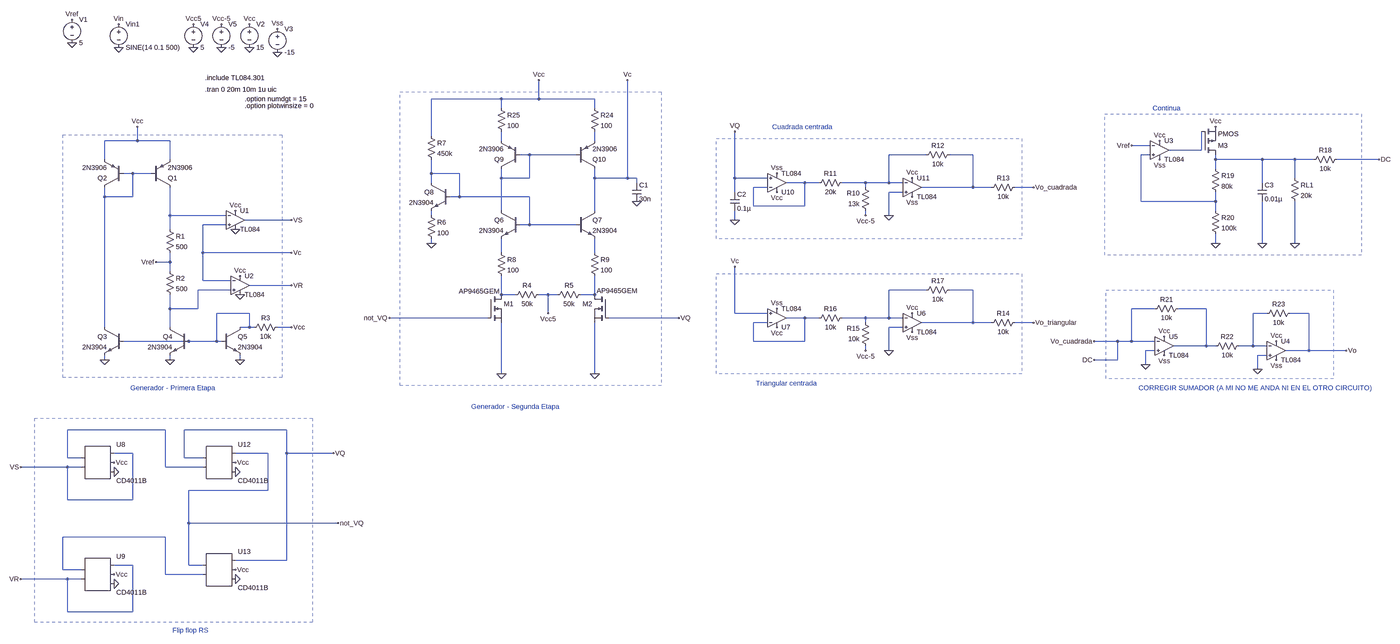
[diagram p0: schematic CIRCUITO_FINAL_PROLIJO3.asc, whole sheet]
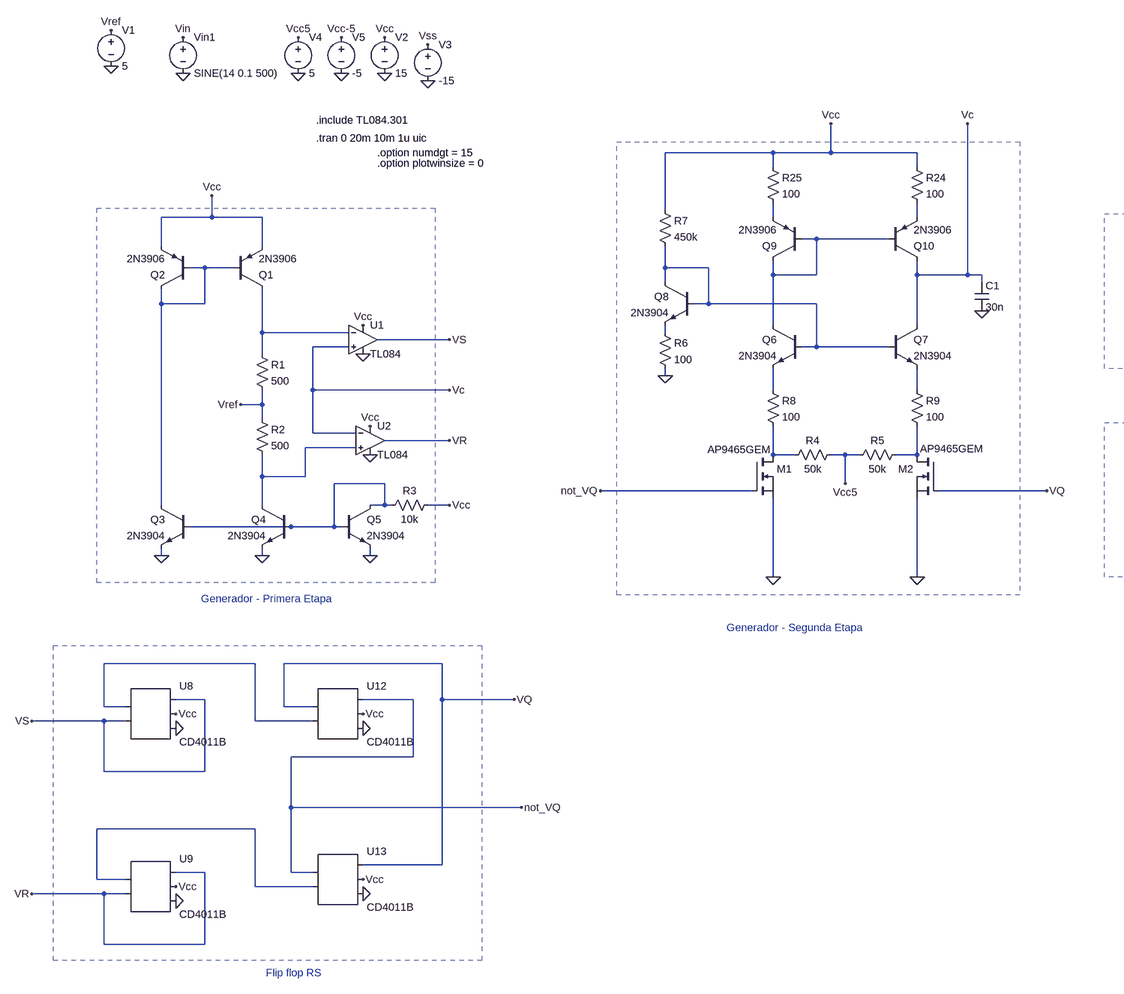
[diagram p1: schematic CIRCUITO_FINAL_PROLIJO3.asc, part, row 1 of 1, column 1 of 2]
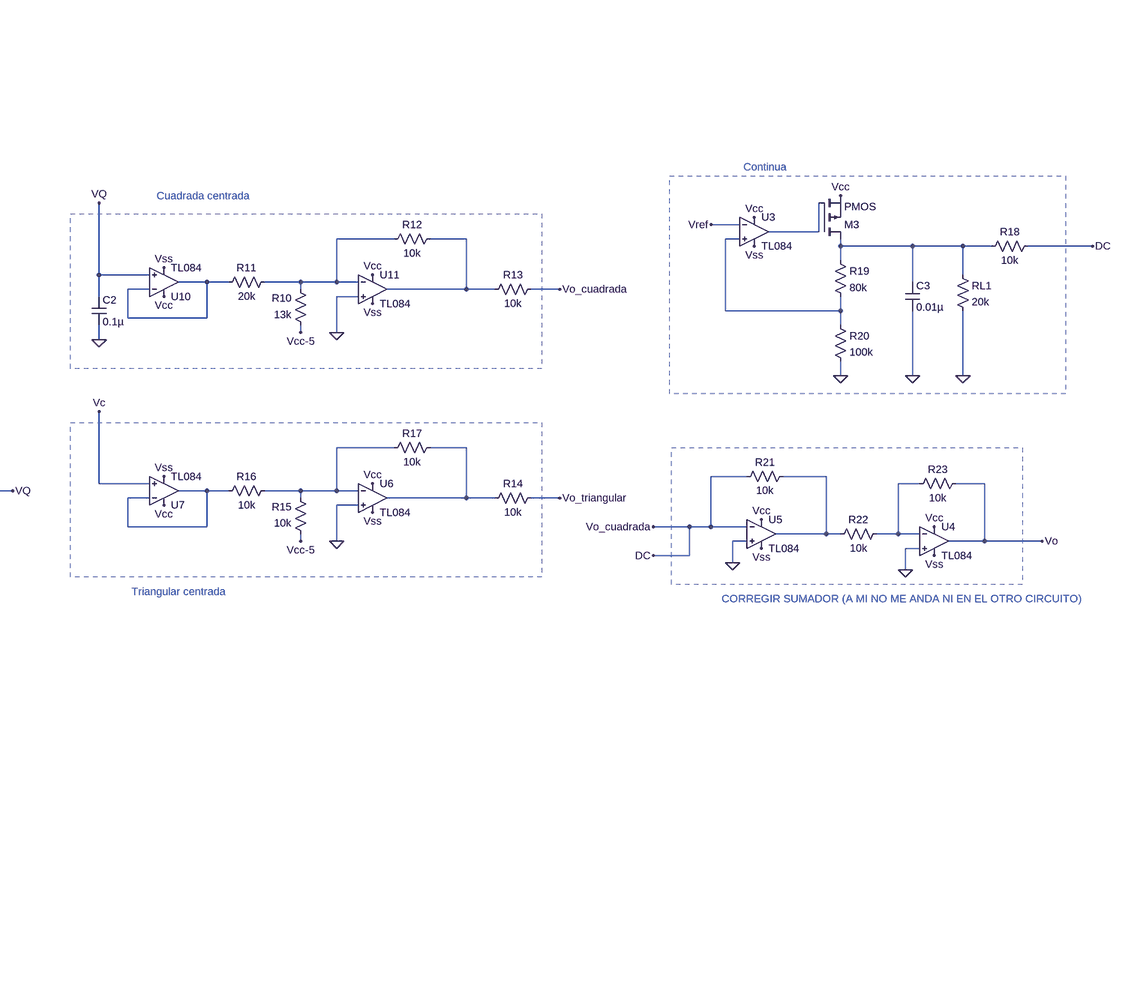
[diagram p2: schematic CIRCUITO_FINAL_PROLIJO3.asc, part, row 1 of 1, column 2 of 2]
CIRCUITO_FINAL_PROLIJO3.asc, the LTspice schematic file:
Version 4
SHEET 1 4360 1968
WIRE 848 -176 608 -176
WIRE 976 -176 976 -240
WIRE 976 -176 848 -176
WIRE 1168 -176 976 -176
WIRE 848 -144 848 -176
WIRE 1168 -144 1168 -176
WIRE 608 -48 608 -176
WIRE -400 -32 -400 -80
WIRE -400 -32 -512 -32
WIRE -288 -32 -400 -32
WIRE 848 -32 848 -64
WIRE 1168 -32 1168 -64
WIRE 3072 -16 3008 -16
WIRE 3248 0 3248 -64
WIRE 3248 0 3136 0
WIRE 944 16 912 16
WIRE 1104 16 944 16
WIRE 2304 16 2176 16
WIRE 2464 16 2384 16
WIRE 3072 16 3040 16
WIRE -512 32 -512 -32
WIRE -288 32 -288 -32
WIRE 3296 32 3296 16
WIRE 3456 32 3296 32
WIRE 3568 32 3456 32
WIRE 3632 32 3568 32
WIRE 3856 32 3712 32
WIRE 3296 64 3296 32
WIRE -416 80 -448 80
WIRE -352 80 -416 80
WIRE 608 80 608 32
WIRE 704 80 608 80
WIRE 848 96 848 64
WIRE 944 96 944 16
WIRE 944 96 848 96
WIRE 1168 96 1168 64
WIRE 1280 96 1280 -240
WIRE 1280 96 1168 96
WIRE 1312 96 1280 96
WIRE 1648 96 1648 -64
WIRE 1760 96 1648 96
WIRE 3568 96 3568 32
WIRE 608 112 608 80
WIRE 1312 112 1312 96
WIRE 1888 112 1824 112
WIRE 1936 112 1888 112
WIRE 2096 112 2016 112
WIRE 2176 112 2176 16
WIRE 2176 112 2096 112
WIRE 2224 112 2176 112
WIRE 3456 112 3456 32
WIRE 1760 128 1712 128
WIRE 2096 128 2096 112
WIRE 2464 128 2464 16
WIRE 2464 128 2288 128
WIRE 2528 128 2464 128
WIRE 2672 128 2608 128
WIRE 1648 144 1648 96
WIRE 2224 144 2176 144
WIRE -512 160 -512 128
WIRE -416 160 -416 80
WIRE -416 160 -512 160
WIRE 704 160 704 80
WIRE 704 160 672 160
WIRE 944 160 704 160
WIRE 3040 176 3040 16
WIRE 3296 176 3296 144
WIRE 3296 176 3040 176
WIRE 1712 192 1712 128
WIRE 1888 192 1888 112
WIRE 1888 192 1712 192
WIRE 848 208 848 96
WIRE 1168 208 1168 96
WIRE 3296 208 3296 176
WIRE -288 224 -288 128
WIRE -96 224 -288 224
WIRE 608 224 608 208
WIRE 2096 224 2096 208
WIRE 2176 224 2176 144
WIRE 128 240 -32 240
WIRE 1648 240 1648 208
WIRE -96 256 -176 256
WIRE 944 256 944 160
WIRE 944 256 912 256
WIRE 1104 256 944 256
WIRE -288 272 -288 224
WIRE 608 320 608 304
WIRE 3296 320 3296 288
WIRE 3456 320 3456 176
WIRE 3568 320 3568 176
WIRE -176 352 -176 256
WIRE 128 352 -176 352
WIRE 848 352 848 304
WIRE 1168 352 1168 304
WIRE -288 384 -288 352
WIRE -288 384 -336 384
WIRE -288 416 -288 384
WIRE -176 448 -176 352
WIRE -80 448 -176 448
WIRE 128 464 -16 464
WIRE -80 480 -192 480
WIRE 2304 480 2176 480
WIRE 2464 480 2384 480
WIRE 848 496 848 432
WIRE 896 496 848 496
WIRE 1008 496 976 496
WIRE 1040 496 1008 496
WIRE 1168 496 1168 432
WIRE 1168 496 1120 496
WIRE -288 544 -288 496
WIRE -192 544 -192 480
WIRE -192 544 -288 544
WIRE 3088 544 3008 544
WIRE 3264 544 3168 544
WIRE -16 560 -128 560
WIRE 1008 560 1008 496
WIRE 1648 560 1648 400
WIRE 1760 560 1648 560
WIRE 3472 560 3424 560
WIRE 3616 560 3552 560
WIRE 800 576 464 576
WIRE 1456 576 1216 576
WIRE 1888 576 1824 576
WIRE 1936 576 1888 576
WIRE 2096 576 2016 576
WIRE 2176 576 2176 480
WIRE 2176 576 2096 576
WIRE 2224 576 2176 576
WIRE 1760 592 1712 592
WIRE 2096 592 2096 576
WIRE 2464 592 2464 480
WIRE 2464 592 2288 592
WIRE 2528 592 2464 592
WIRE 2672 592 2608 592
WIRE -512 608 -512 160
WIRE -288 608 -288 544
WIRE -16 608 -16 560
WIRE -16 608 -48 608
WIRE 0 608 -16 608
WIRE 128 608 80 608
WIRE 2224 608 2176 608
WIRE -224 656 -448 656
WIRE -128 656 -128 560
WIRE -128 656 -224 656
WIRE -112 656 -128 656
WIRE 1712 656 1712 592
WIRE 1888 656 1888 576
WIRE 1888 656 1712 656
WIRE 2960 656 2880 656
WIRE 3008 656 3008 544
WIRE 3008 656 2960 656
WIRE 3088 656 3008 656
WIRE 3264 672 3264 544
WIRE 3264 672 3152 672
WIRE 3296 672 3264 672
WIRE 3424 672 3424 560
WIRE 3424 672 3376 672
WIRE 3472 672 3424 672
WIRE 2096 688 2096 672
WIRE 2176 688 2176 608
WIRE 3088 688 3056 688
WIRE 3616 688 3616 560
WIRE 3616 688 3536 688
WIRE 3744 688 3616 688
WIRE 3472 704 3440 704
WIRE -512 720 -512 704
WIRE -288 720 -288 704
WIRE -48 720 -48 704
WIRE 2960 720 2960 656
WIRE 2960 720 2880 720
WIRE 3056 736 3056 688
WIRE 3440 752 3440 704
WIRE 848 768 848 592
WIRE 1168 768 1168 592
WIRE -304 960 -640 960
WIRE 112 960 -240 960
WIRE -416 1040 -480 1040
WIRE 48 1040 -64 1040
WIRE 112 1040 112 960
WIRE 272 1040 112 1040
WIRE -640 1056 -640 960
WIRE -592 1056 -640 1056
WIRE -240 1056 -240 960
WIRE -176 1056 -240 1056
WIRE -640 1088 -800 1088
WIRE -592 1088 -640 1088
WIRE -304 1088 -304 960
WIRE -176 1088 -304 1088
WIRE 48 1168 48 1040
WIRE 48 1168 -224 1168
WIRE -640 1200 -640 1088
WIRE -416 1200 -416 1040
WIRE -416 1200 -640 1200
WIRE -224 1280 -224 1168
WIRE 288 1280 -224 1280
WIRE -304 1328 -656 1328
WIRE 112 1408 112 1040
WIRE 112 1408 -64 1408
WIRE -416 1424 -480 1424
WIRE -224 1424 -224 1280
WIRE -176 1424 -224 1424
WIRE -656 1440 -656 1328
WIRE -592 1440 -656 1440
WIRE -304 1456 -304 1328
WIRE -176 1456 -304 1456
WIRE -640 1472 -800 1472
WIRE -592 1472 -640 1472
WIRE -640 1584 -640 1472
WIRE -416 1584 -416 1424
WIRE -416 1584 -640 1584
FLAG -48 720 0
FLAG -288 720 0
FLAG -512 720 0
FLAG 608 320 0
FLAG 1312 176 0
FLAG 976 -240 Vcc
FLAG 1008 560 Vcc5
FLAG 1168 768 0
FLAG 848 768 0
FLAG -400 -80 Vcc
FLAG 128 608 Vcc
FLAG 128 240 VS
FLAG 128 464 VR
FLAG -336 384 Vref
FLAG 128 352 Vc
FLAG 1456 576 VQ
FLAG 464 576 not_VQ
FLAG 1280 -240 Vc
FLAG -624 -368 0
FLAG -16 -432 Vcc
FLAG 80 -416 Vss
FLAG 80 -336 0
FLAG -16 -352 0
FLAG -208 -432 Vcc5
FLAG -208 -352 0
FLAG -112 -352 0
FLAG -112 -432 Vcc-5
FLAG -464 -432 Vin
FLAG -464 -352 0
FLAG -624 -448 Vref
FLAG 1792 144 Vcc
FLAG 1792 80 Vss
FLAG 1648 240 0
FLAG 2096 224 Vcc-5
FLAG 2176 224 0
FLAG 1648 -64 VQ
FLAG 2672 128 Vo_cuadrada
FLAG 3296 320 0
FLAG 3568 320 0
FLAG 3456 320 0
FLAG 3856 32 DC
FLAG 3744 688 Vo
FLAG 3056 736 0
FLAG 3440 752 0
FLAG 2256 96 Vcc
FLAG 2256 160 Vss
FLAG 1792 608 Vcc
FLAG 1792 544 Vss
FLAG 2096 688 Vcc-5
FLAG 2176 688 0
FLAG 1648 400 Vc
FLAG 2672 592 Vo_triangular
FLAG 2256 560 Vcc
FLAG 2256 624 Vss
FLAG 3104 -32 Vcc
FLAG 3104 32 Vss
FLAG 3504 656 Vcc
FLAG 3504 720 Vss
FLAG 3120 640 Vcc
FLAG 3120 704 Vss
FLAG -64 208 Vcc
FLAG -64 272 0
FLAG -48 432 Vcc
FLAG -48 496 0
FLAG -800 1088 VS
FLAG -800 1472 VR
FLAG -480 1488 0
FLAG -480 1104 0
FLAG -480 1072 Vcc
FLAG -480 1456 Vcc
FLAG -64 1440 Vcc
FLAG -64 1472 0
FLAG -64 1104 0
FLAG -64 1072 Vcc
FLAG 272 1040 VQ
FLAG 288 1280 not_VQ
FLAG 2880 720 DC
FLAG 2880 656 Vo_cuadrada
FLAG 3008 -16 Vref
FLAG 3296 -80 Vcc
SYMBOL pnp -352 128 M180
SYMATTR InstName Q1
SYMATTR Value 2N3906
SYMBOL pnp -448 128 R180
SYMATTR InstName Q2
SYMATTR Value 2N3906
SYMBOL npn -448 608 M0
SYMATTR InstName Q3
SYMATTR Value 2N3904
SYMBOL res -304 256 R0
SYMATTR InstName R1
SYMATTR Value 500
SYMBOL res -304 400 R0
SYMATTR InstName R2
SYMATTR Value 500
SYMBOL npn -224 608 M0
SYMATTR InstName Q4
SYMATTR Value 2N3904
SYMBOL npn -112 608 R0
SYMATTR InstName Q5
SYMATTR Value 2N3904
SYMBOL res 96 592 R90
WINDOW 0 0 56 VBottom 2
WINDOW 3 32 56 VTop 2
SYMATTR InstName R3
SYMATTR Value 10k
SYMBOL res 992 480 R90
WINDOW 0 0 56 VBottom 2
WINDOW 3 32 56 VTop 2
SYMATTR InstName R4
SYMATTR Value 50k
SYMBOL res 1136 480 R90
WINDOW 0 0 56 VBottom 2
WINDOW 3 32 56 VTop 2
SYMATTR InstName R5
SYMATTR Value 50k
SYMBOL npn 1104 208 R0
SYMATTR InstName Q7
SYMATTR Value 2N3904
SYMBOL npn 912 208 M0
SYMATTR InstName Q6
SYMATTR Value 2N3904
SYMBOL npn 672 112 M0
SYMATTR InstName Q8
SYMATTR Value 2N3904
SYMBOL res 592 208 R0
SYMATTR InstName R6
SYMATTR Value 100
SYMBOL res 592 -64 R0
SYMATTR InstName R7
SYMATTR Value 450k
SYMBOL cap 1296 112 R0
SYMATTR InstName C1
SYMATTR Value 30n
SYMBOL pnp 912 64 R180
SYMATTR InstName Q9
SYMATTR Value 2N3906
SYMBOL pnp 1104 64 M180
SYMATTR InstName Q10
SYMATTR Value 2N3906
SYMBOL nmos 800 496 R0
WINDOW 3 -98 -12 Left 2
SYMATTR Value AP9465GEM
SYMATTR InstName M1
SYMBOL nmos 1216 496 M0
WINDOW 3 -99 -13 Left 2
SYMATTR Value AP9465GEM
SYMATTR InstName M2
SYMBOL voltage -624 -464 R0
WINDOW 123 0 0 Left 2
WINDOW 39 0 0 Left 2
SYMATTR InstName V1
SYMATTR Value 5
SYMBOL voltage -16 -448 R0
WINDOW 123 0 0 Left 2
WINDOW 39 0 0 Left 2
SYMATTR InstName V2
SYMATTR Value 15
SYMBOL voltage 80 -432 R0
WINDOW 123 0 0 Left 2
WINDOW 39 0 0 Left 2
SYMATTR InstName V3
SYMATTR Value -15
SYMBOL voltage -208 -448 R0
WINDOW 123 0 0 Left 2
WINDOW 39 0 0 Left 2
SYMATTR InstName V4
SYMATTR Value 5
SYMBOL voltage -112 -448 R0
WINDOW 123 0 0 Left 2
WINDOW 39 0 0 Left 2
SYMATTR InstName V5
SYMATTR Value -5
SYMBOL voltage -464 -448 R0
WINDOW 123 0 0 Left 2
WINDOW 39 0 0 Left 2
SYMATTR InstName Vin1
SYMATTR Value SINE(14 0.1 500)
SYMBOL cap 1632 144 R0
SYMATTR InstName C2
SYMATTR Value 0.1µ
SYMBOL res 2112 224 R180
WINDOW 0 36 76 Left 2
WINDOW 3 36 40 Left 2
SYMATTR InstName R10
SYMATTR Value 13k
SYMBOL res 2032 96 R90
WINDOW 0 0 56 VBottom 2
WINDOW 3 32 56 VTop 2
SYMATTR InstName R11
SYMATTR Value 20k
SYMBOL res 2400 0 R90
WINDOW 0 0 56 VBottom 2
WINDOW 3 32 56 VTop 2
SYMATTR InstName R12
SYMATTR Value 10k
SYMBOL res 2512 144 R270
WINDOW 0 32 56 VTop 2
WINDOW 3 0 56 VBottom 2
SYMATTR InstName R13
SYMATTR Value 10k
SYMBOL res 3552 80 R0
SYMATTR InstName RL1
SYMATTR Value 20k
SYMBOL res 3728 16 R90
WINDOW 0 0 56 VBottom 2
WINDOW 3 32 56 VTop 2
SYMATTR InstName R18
SYMATTR Value 10k
SYMBOL cap 3440 112 R0
SYMATTR InstName C3
SYMATTR Value 0.01µ
SYMBOL res 3280 48 R0
SYMATTR InstName R19
SYMATTR Value 80k
SYMBOL res 3280 192 R0
SYMATTR InstName R20
SYMATTR Value 100k
SYMBOL pmos 3248 16 M180
SYMATTR InstName M3
SYMBOL res 3184 528 R90
WINDOW 0 0 56 VBottom 2
WINDOW 3 32 56 VTop 2
SYMATTR InstName R21
SYMATTR Value 10k
SYMBOL res 3392 656 R90
WINDOW 0 0 56 VBottom 2
WINDOW 3 32 56 VTop 2
SYMATTR InstName R22
SYMATTR Value 10k
SYMBOL res 3568 544 R90
WINDOW 0 0 56 VBottom 2
WINDOW 3 32 56 VTop 2
SYMATTR InstName R23
SYMATTR Value 10k
SYMBOL opamp2 1792 176 M180
SYMATTR InstName U10
SYMATTR Value TL084
SYMBOL opamp2 2256 64 R0
SYMATTR InstName U11
SYMATTR Value TL084
SYMBOL res 2112 688 R180
WINDOW 0 36 76 Left 2
WINDOW 3 36 40 Left 2
SYMATTR InstName R15
SYMATTR Value 10k
SYMBOL res 2032 560 R90
WINDOW 0 0 56 VBottom 2
WINDOW 3 32 56 VTop 2
SYMATTR InstName R16
SYMATTR Value 10k
SYMBOL res 2400 464 R90
WINDOW 0 0 56 VBottom 2
WINDOW 3 32 56 VTop 2
SYMATTR InstName R17
SYMATTR Value 10k
SYMBOL res 2512 608 R270
WINDOW 0 32 56 VTop 2
WINDOW 3 0 56 VBottom 2
SYMATTR InstName R14
SYMATTR Value 10k
SYMBOL opamp2 1792 640 M180
SYMATTR InstName U7
SYMATTR Value TL084
SYMBOL opamp2 2256 528 R0
SYMATTR InstName U6
SYMATTR Value TL084
SYMBOL opamp2 3104 -64 R0
SYMATTR InstName U3
SYMATTR Value TL084
SYMBOL opamp2 3504 624 R0
SYMATTR InstName U4
SYMATTR Value TL084
SYMBOL opamp2 3120 608 R0
SYMATTR InstName U5
SYMATTR Value TL084
SYMBOL opamp2 -48 400 R0
SYMATTR InstName U2
SYMATTR Value TL084
SYMBOL opamp2 -64 176 R0
SYMATTR InstName U1
SYMATTR Value TL084
SYMBOL AutoGenerated/CD4011B -544 1072 R0
SYMATTR InstName U8
SYMBOL AutoGenerated/CD4011B -544 1456 R0
SYMATTR InstName U9
SYMBOL AutoGenerated/CD4011B -128 1072 R0
SYMATTR InstName U12
SYMBOL AutoGenerated/CD4011B -128 1440 R0
SYMATTR InstName U13
SYMBOL res 832 336 R0
SYMATTR InstName R8
SYMATTR Value 100
SYMBOL res 1152 336 R0
SYMATTR InstName R9
SYMATTR Value 100
SYMBOL res 1152 -160 R0
SYMATTR InstName R24
SYMATTR Value 100
SYMBOL res 832 -160 R0
SYMATTR InstName R25
SYMATTR Value 100
TEXT -424 816 Left 2 ;Generador - Primera Etapa
TEXT 744 880 Left 2 ;Generador - Segunda Etapa
TEXT -168 -208 Left 2 !.tran 0 20m 10m 1u uic
TEXT 1720 800 Left 2 ;Triangular centrada
TEXT 1776 -80 Left 2 ;Cuadrada centrada
TEXT 3080 -144 Left 2 ;Continua
TEXT 3032 816 Left 2 ;CORREGIR SUMADOR (A MI NO ME ANDA NI EN EL OTRO CIRCUITO)
TEXT -168 -248 Left 2 !.include TL084.301
TEXT -280 1648 Left 2 ;Flip flop RS
TEXT -32 -176 Left 2 !.option numdgt = 15
TEXT -32 -152 Left 2 !.option plotwinsize = 0
RECTANGLE Normal -656 -52 96 780 2
RECTANGLE Normal 1584 -40 2632 304 2
RECTANGLE Normal 2916 -124 3796 360 2
RECTANGLE Normal 2920 480 3700 784 2
RECTANGLE Normal 1584 424 2632 768 2
RECTANGLE Normal -752 920 200 1620 2
RECTANGLE Normal 500 -200 1396 808 2

The netlist it stands for:
* CIRCUITO_FINAL_PROLIJO3.asc
Q1 N012 N009 Vcc 0 2N3906
Q2 N009 N009 Vcc 0 2N3906
Q3 N009 N022 0 0 2N3904
R1 N012 Vref 500
R2 Vref N016 500
Q4 N016 N022 0 0 2N3904
Q5 N022 N022 0 0 2N3904
R3 Vcc N022 10k
R4 Vcc5 N019 50k
R5 N020 Vcc5 50k
Q7 Vc N010 N015 0 2N3904
Q6 N004 N010 N014 0 2N3904
Q8 N010 N010 N013 0 2N3904
R6 N013 0 100
R7 Vcc N010 450k
C1 Vc 0 30n
Q9 N004 N004 N001 0 2N3906
Q10 Vc N004 N002 0 2N3906
M1 N019 not_VQ 0 0 AP9465GEM
M2 N020 VQ 0 0 AP9465GEM
V1 Vref 0 5
V2 Vcc 0 15
V3 Vss 0 -15
V4 Vcc5 0 5
V5 Vcc-5 0 -5
Vin1 Vin 0 SINE(14 0.1 500)
C2 VQ 0 0.1µ
R10 Vcc-5 N005 13k
R11 N005 N011 20k
R12 N006 N005 10k
R13 N006 DC 10k
RL1 N008 0 20k
R18 DC N008 10k
C3 N008 0 0.01µ
R19 N008 N007 80k
R20 N007 0 100k
M3 N008 N003 Vcc Vcc PMOS
R21 N021 DC 10k
R22 N023 N021 10k
R23 Vo N023 10k
XU10 VQ N011 Vcc Vss N011 TL084  ; pins In+ In- V+ V- OUT
XU11 0 N005 Vcc Vss N006 TL084  ; pins In+ In- V+ V- OUT
R15 Vcc-5 N017 10k
R16 N017 N024 10k
R17 N018 N017 10k
R14 N018 Vo_triangular 10k
XU7 Vc N024 Vcc Vss N024 TL084  ; pins In+ In- V+ V- OUT
XU6 0 N017 Vcc Vss N018 TL084  ; pins In+ In- V+ V- OUT
XU3 N007 Vref Vcc Vss N003 TL084  ; pins In+ In- V+ V- OUT
XU4 0 N023 Vcc Vss Vo TL084  ; pins In+ In- V+ V- OUT
XU5 0 DC Vcc Vss N021 TL084  ; pins In+ In- V+ V- OUT
XU2 N016 Vc Vcc 0 VR TL084  ; pins In+ In- V+ V- OUT
XU1 Vc N012 Vcc 0 VS TL084  ; pins In+ In- V+ V- OUT
* U8: CD4011B (symbol AutoGenerated/CD4011B not available, pins judged from their places): pin1=N025 pin2=VS pin3=VS pin4=Vcc pin5=0
* U9: CD4011B (symbol AutoGenerated/CD4011B not available, pins judged from their places): pin1=N026 pin2=VR pin3=VR pin4=Vcc pin5=0
* U12: CD4011B (symbol AutoGenerated/CD4011B not available, pins judged from their places): pin1=VQ pin2=N025 pin3=not_VQ pin4=Vcc pin5=0
* U13: CD4011B (symbol AutoGenerated/CD4011B not available, pins judged from their places): pin1=not_VQ pin2=N026 pin3=VQ pin4=Vcc pin5=0
R8 N014 N019 100
R9 N015 N020 100
R24 Vcc N002 100
R25 Vcc N001 100
.model NPN NPN
.model PNP PNP
.lib standard.bjt
.model NMOS NMOS
.model PMOS PMOS
.lib standard.mos
* Generador - Primera Etapa
* Generador - Segunda Etapa
.tran 0 20m 10m 1u uic
* Triangular centrada
* Cuadrada centrada
* Continua
* CORREGIR SUMADOR (A MI NO ME ANDA NI EN EL OTRO CIRCUITO)
.include TL084.301
* Flip flop RS
.option numdgt = 15
.option plotwinsize = 0
.backanno
.end